# Altium project STM32F103Core.PrjPcb
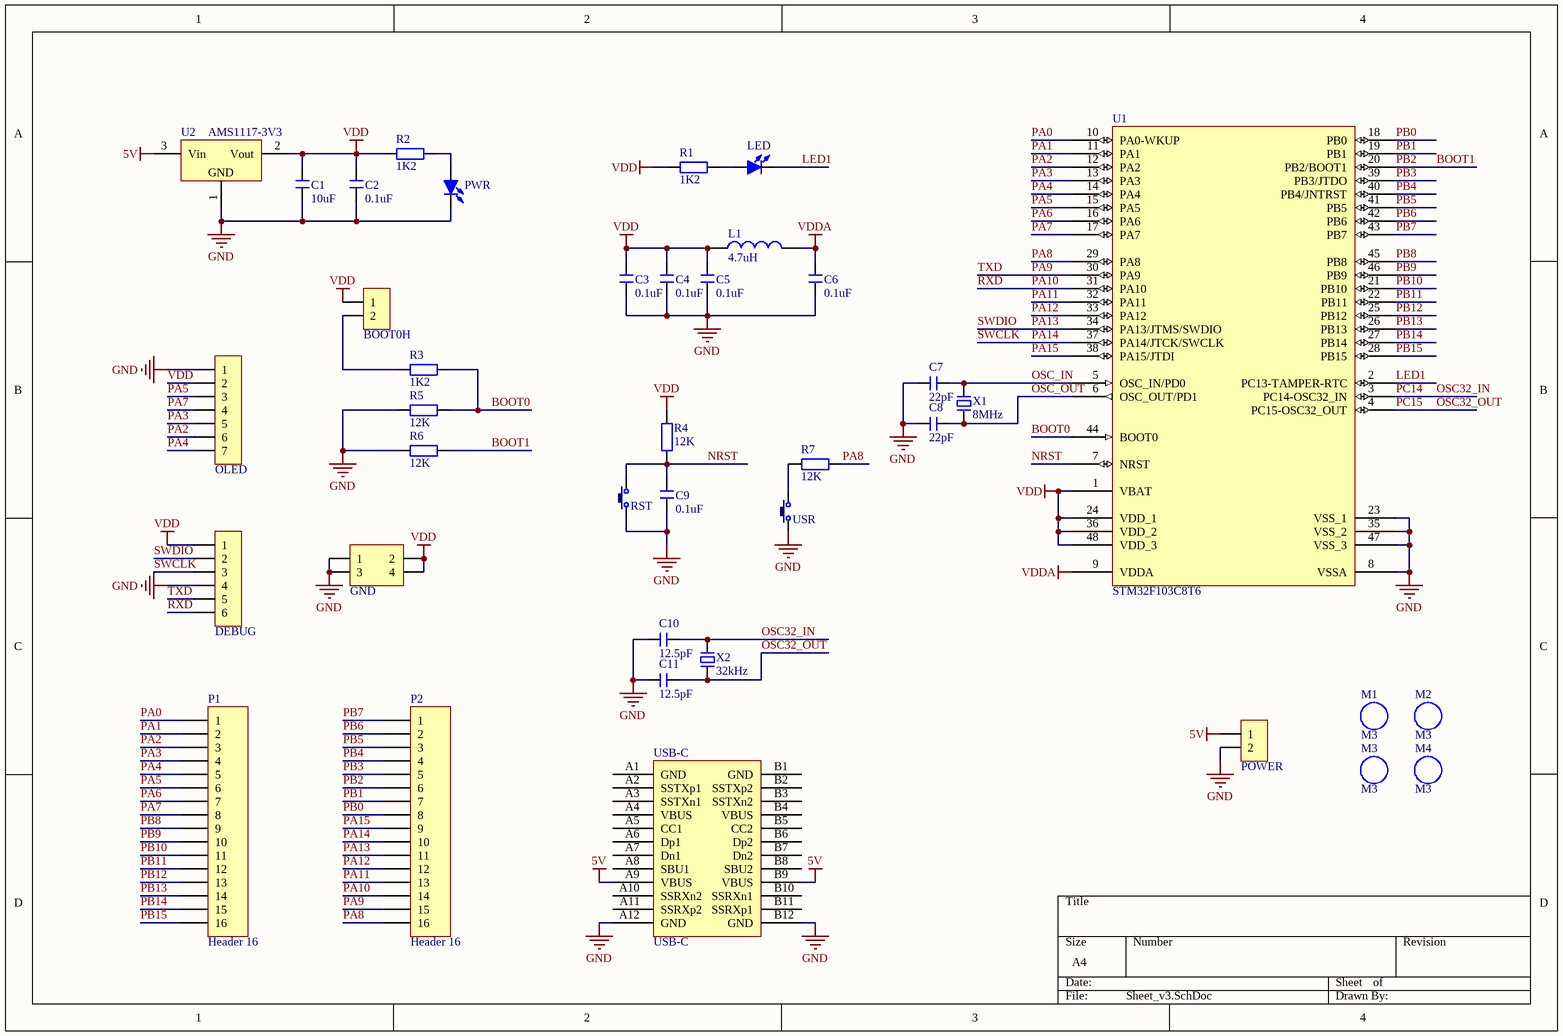
[diagram p0: Sheet_v3.SchDoc]
1 sheet, 39 parts. Net scope: global (net labels, ports and power ports of the same name join across sheets).
Board file: PCB_v3.PcbDoc

## Sheet Sheet_v3.SchDoc
size A4

### Parts
BOOT0H  HDR-1X2  [TSW SMD-3*4*2.5]  (value not drawn)
C1  10uF  [C 0805]
C2  0.1uF  [C 0603]
C3  0.1uF  [C 0603]
C4  0.1uF  [C 0603]
C5  0.1uF  [C 0603]
C6  0.1uF  [C 0603]
C7  22pF  [C 0603]
C8  22pF  [C 0603]
C9  0.1uF  [C 0603]
C10  12.5pF  [C 0603]
C11  12.5pF  [C 0603]
DEBUG  HDR-1X6  [HDR-1X6]  (value not drawn)
GND  Header2X2  [HDR-2X2]  (value not drawn)
L1  4.7uH  [L 0805]
LED  (no value)  [LED 0805G]
M1  M3  [M3 125X200]
M2  M3  [M3 125X200]
M3  M3  [M3 125X200]
M4  M3  [M3 125X200]
OLED  HDR-1X7  [HDR-1X7_M]  (value not drawn)
P1  Header 16  [HDR1X16]
P2  Header 16  [HDR1X16]
POWER  HDR-1X2  [HDR-1X2]  (value not drawn)
PWR  (no value)  [LED 0805G]
R1  1K2  [R 0805]
R2  1K2  [R 0805]
R3  1K2  [R 0805]
R4  12K  [R 0805]
R5  12K  [R 0805]
R6  12K  [R 0805]
R7  12K  [R 0805]
RST  3x6x5  [TSW SMD-3*6*2.5]  (value not drawn)
U1  STM32F103C8T6  [LQFP48 7X7_M]
U2  AMS1117-3V3  [SOT223_M]
USB-C  USB-C  [Type_C-6P]
USR  3x6x5  [TSW SMD-3*6*2.5]  (value not drawn)
X1  8MHz  [XTAL-5032_2P]
X2  32kHz  [XTAL-3215]

### Nets
5V: POWER.1 U2.3(Vin) USB-C.A9(VBUS) USB-C.B9(VBUS)
GND: C1.1 C2.1 C3.1 C4.1 C5.1 C6.1 C7.1 C8.1 C9.1 C10.1 C11.1 DEBUG.4 GND.1 GND.3 OLED.1 POWER.2 PWR.2(K) R5.2 R6.2 RST.1 U1.8(VSSA) U1.23(VSS_1) U1.35(VSS_2) U1.47(VSS_3) U2.1(GND) USB-C.A12(GND) USB-C.B12(GND) USR.1
VDD: BOOT0H.1 C1.2 C2.2 C3.2 C4.2 C5.2 DEBUG.1 GND.2 GND.4 L1.1 OLED.2 R1.1 R2.1 R4.2 U1.1(VBAT) U1.24(VDD_1) U1.36(VDD_2) U1.48(VDD_3) U2.2(Vout)
VDDA: C6.2 L1.2 U1.9(VDDA)
BOOT0: R3.1 R5.1 U1.44(BOOT0)
BOOT1: P2.6 R6.1 U1.20(PB2/BOOT1)  [also labelled PB2]
LED1: LED.2(K) U1.2(PC13-TAMPER-RTC)
NRST: C9.2 R4.1 RST.2 U1.7(NRST)
OSC32_IN: C10.2 U1.3(PC14-OSC32_IN) X2.2  [also labelled PC14]
OSC32_OUT: C11.2 U1.4(PC15-OSC32_OUT) X2.1  [also labelled PC15]
OSC_IN: C7.2 U1.5(OSC_IN/PD0) X1.2
OSC_OUT: C8.2 U1.6(OSC_OUT/PD1) X1.1
PA0: P1.1 U1.10(PA0-WKUP)
PA1: P1.2 U1.11(PA1)
PA2: OLED.6 P1.3 U1.12(PA2)
PA3: OLED.5 P1.4 U1.13(PA3)
PA4: OLED.7 P1.5 U1.14(PA4)
PA5: OLED.3 P1.6 U1.15(PA5)
PA6: P1.7 U1.16(PA6)
PA7: OLED.4 P1.8 U1.17(PA7)
PA8: P2.16 R7.2 U1.29(PA8)
PA9: DEBUG.5 P2.15 U1.30(PA9)  [also labelled TXD]
PA10: DEBUG.6 P2.14 U1.31(PA10)  [also labelled RXD]
PA11: P2.13 U1.32(PA11)
PA12: P2.12 U1.33(PA12)
PA13: DEBUG.2 P2.11 U1.34(PA13/JTMS/SWDIO)  [also labelled SWDIO]
PA14: DEBUG.3 P2.10 U1.37(PA14/JTCK/SWCLK)  [also labelled SWCLK]
PA15: P2.9 U1.38(PA15/JTDI)
PB0: P2.8 U1.18(PB0)
PB1: P2.7 U1.19(PB1)
PB3: P2.5 U1.39(PB3/JTDO)
PB4: P2.4 U1.40(PB4/JNTRST)
PB5: P2.3 U1.41(PB5)
PB6: P2.2 U1.42(PB6)
PB7: P2.1 U1.43(PB7)
PB8: P1.9 U1.45(PB8)
PB9: P1.10 U1.46(PB9)
PB10: P1.11 U1.21(PB10)
PB11: P1.12 U1.22(PB11)
PB12: P1.13 U1.25(PB12)
PB13: P1.14 U1.26(PB13)
PB14: P1.15 U1.27(PB14)
PB15: P1.16 U1.28(PB15)
NetBOOT0H_2: BOOT0H.2 R3.2
NetLED_1: LED.1(A) R1.2
NetPWR_1: PWR.1(A) R2.2
NetR7_1: R7.1 USR.2

Not connected (* = marked no-connect by the designer): USB-C A1(GND) A2(SSTXp1) A3(SSTXn1) A4(VBUS) A5(CC1) A6(Dp1) A7(Dn1) A8(SBU1) A10(SSRXn2) A11(SSRXp2) B1(GND) B2(SSTXp2) B3(SSTXn2) B4(VBUS) B5(CC2) B6(Dp2) B7(Dn2) B8(SBU2) B10(SSRXn1) B11(SSRXp1)

### Library data of the parts
BOOT0H POWER = Header 2: 2P接插件; 版权归属: 源创客; BOM名称: 2P接插件; 学习资源: www.ooocke.com
C1-C11 = C: 无极性贴片电容; 版权归属: 源创客; BOM名称: 无极性贴片电容; 学习资源: www.ooocke.com
DEBUG = Header 6: 6P接插件; 版权归属: 源创客; BOM名称: 6P接插件; 学习资源: www.ooocke.com
GND = Header 2X2: 2*2P接插件; 版权归属: 源创客; BOM名称: 2*2P接插件; 学习资源: www.ooocke.com
L1 = L: 小功率贴片电感; 版权归属: 源创客; BOM名称: 小功率贴片电感; 学习资源: www.ooocke.com
LED PWR = LED-SMD: 贴片LED; 版权归属: 源创客; BOM名称: 贴片LED; 学习资源: www.ooocke.com
M1-M4 = M3: 铜柱孔; 版权归属: 源创客; BOM名称: 铜柱孔; 学习资源: www.ooocke.com
OLED = Header 7: 7P接插件; 版权归属: 源创客; BOM名称: 7P接插件; 学习资源: www.ooocke.com
P1 P2 = Header 16: Header, 16-Pin; LatestRevisionDate: 17-Jul-2002; LatestRevisionNote: Re-released for DXP Platform.; Publisher: Altium Limited
R1-R7 = R: 贴片电阻; 版权归属: 源创客; BOM名称: 贴片电阻; 学习资源: www.ooocke.com
RST USR = TSW 3x6: 3x6轻触开关; 版权归属: 源创客; BOM名称: 3x6轻触开关; 学习资源: www.ooocke.com
U1 = STM32F103C8T6: Flaah:64/RAM:20/IO:36; BOM名称: 32位STM单片机; 版权归属: 源创客; 学习资源: www.ooocke.com
U2 = AMS1117: 三端稳压芯片; BOM名称: 稳压芯片; 版权归属: 源创客; 学习资源: www.ooocke.com
USB-C = USB-C/S: USB-C型母接口; 版权归属: 源创客; BOM名称: USB-C型母接口; 学习资源: www.ooocke.com
X1 X2 = XTAL-2: 2脚晶振; 版权归属: 源创客; BOM名称: 2脚晶振; 学习资源: www.ooocke.com